# EAGLE design 00A-053 (EAGLE 9.6.2)
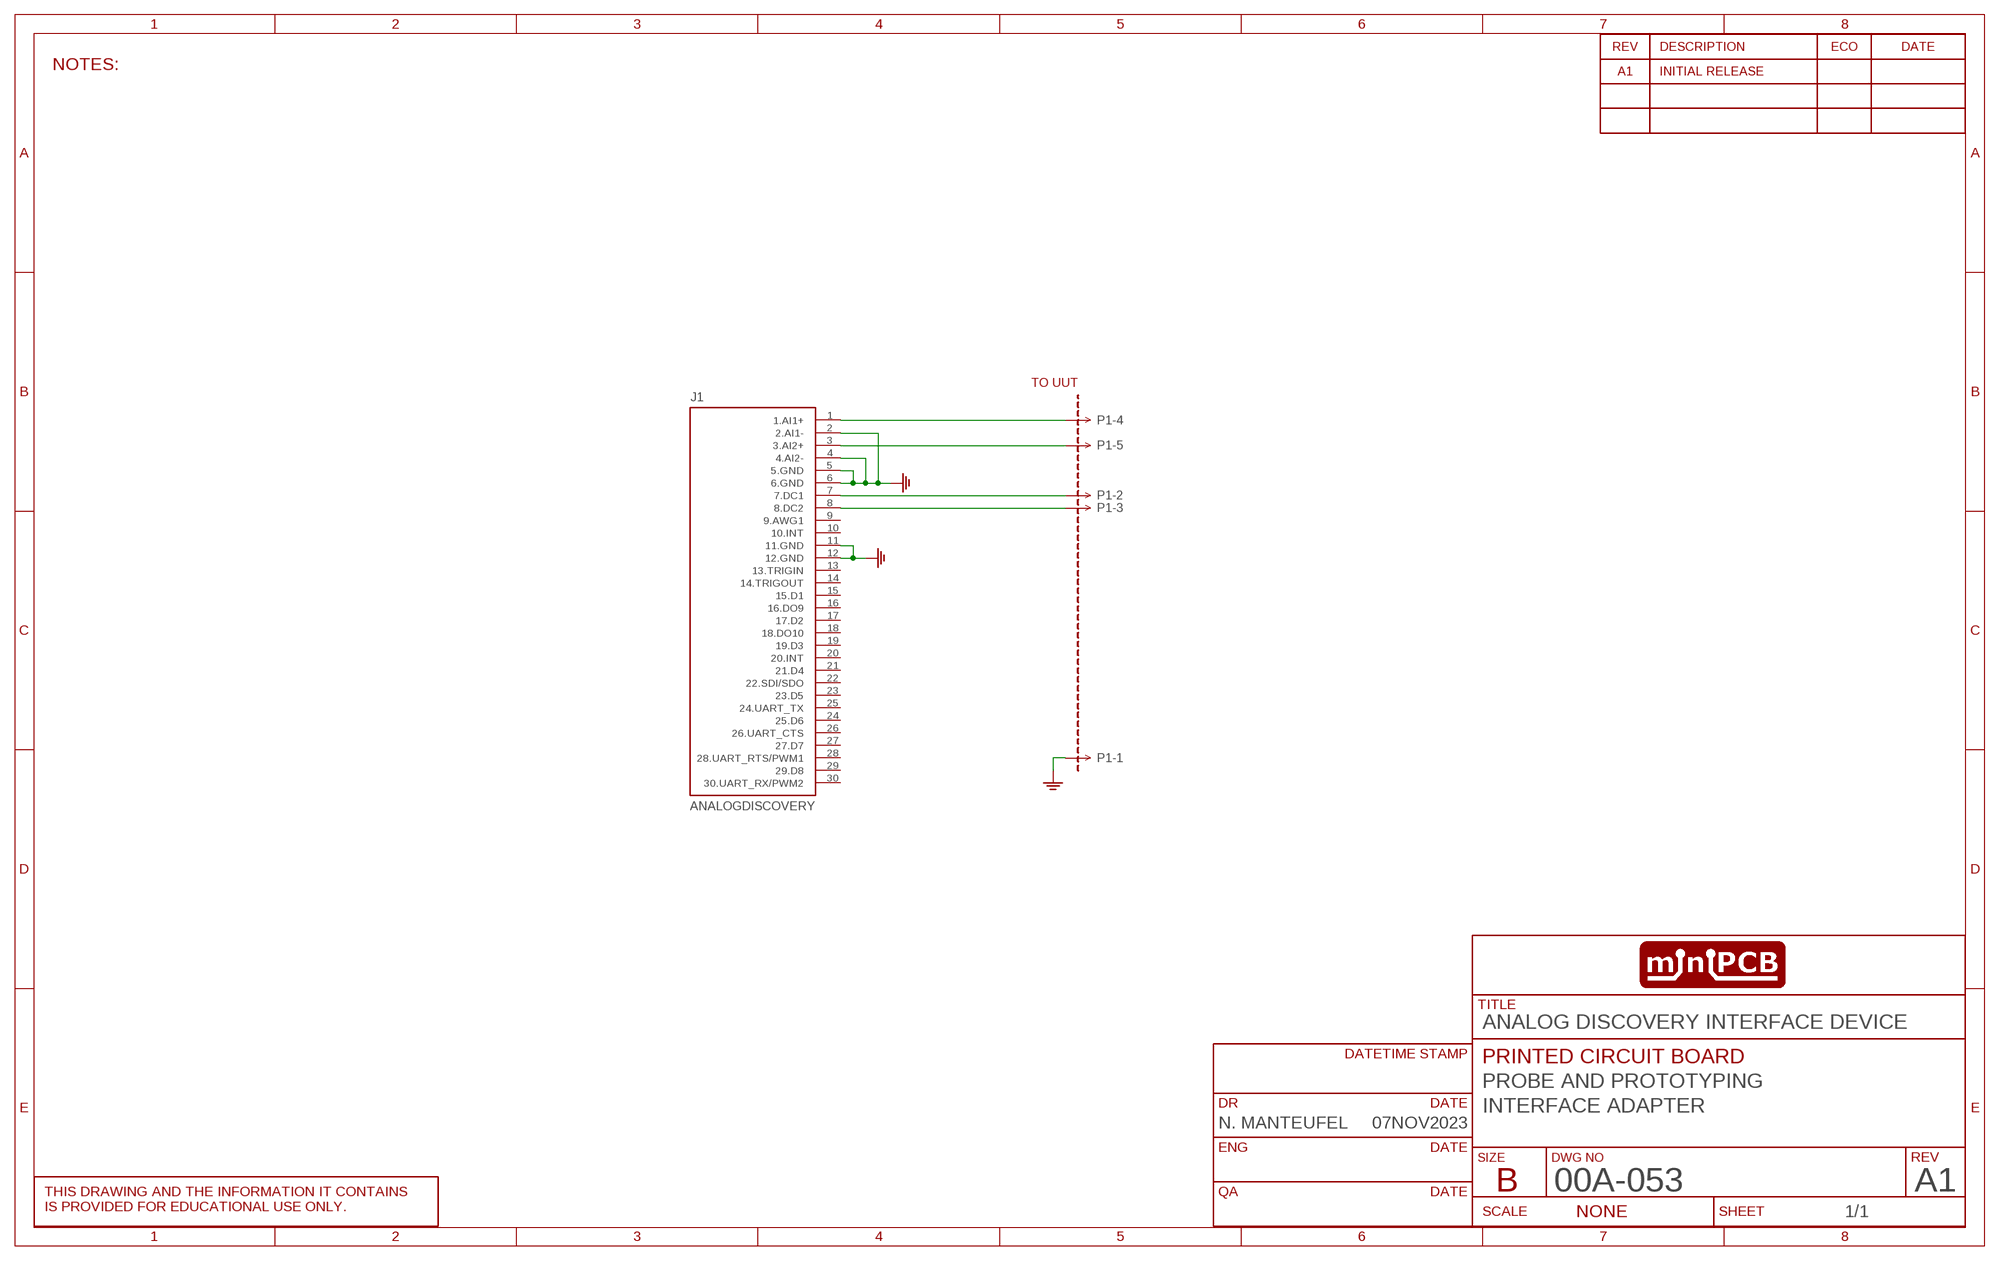
[diagram p0: schematic, sheet 1]
SHEET1 (SCHEMATIC): CIRCUIT_CATEGORY: PROBE AND PROTOTYPING; CIRCUIT_NAME: INTERFACE ADAPTER; DR: N. MANTEUFEL; DR_DATE: 07NOV2023; PCB_PCBA: PRINTED CIRCUIT BOARD; REVA: A1; REVISION: A1; TITLE: ANALOG DISCOVERY INTERFACE DEVICE

## Parts
J1  ANALOGDISCOVERY  [PINS30-2X15]
P1  MINIPCB_5P5P  [PINS_1X5]
PCB1  MINIPCB_0P25X50  [MINIPCB_0P_25X50]

## Nets
GND: J1.2(2.AI1-) J1.4(4.AI2-) J1.5(5.GND) J1.6(6.GND) J1.11(11.GND) J1.12(12.GND) P1.1
N$1: J1.3(3.AI2+) P1.5
N$2: J1.1(1.AI1+) P1.4
N$3: J1.7(7.DC1) P1.2
N$4: J1.8(8.DC2) P1.3
Unconnected: J1.9(9.AWG1) J1.10(10.INT) J1.13(13.TRIGIN) J1.14(14.TRIGOUT) J1.15(15.D1) J1.16(16.DO9) J1.17(17.D2) J1.18(18.DO10) J1.19(19.D3) J1.20(20.INT) J1.21(21.D4) J1.22(22.SDI/SDO) J1.23(23.D5) J1.24(25.D6) J1.25(24.UART_TX) J1.26(26.UART_CTS) J1.27(27.D7) J1.28(28.UART_RTS/PWM1) J1.29(29.D8) J1.30(30.UART_RX/PWM2)

## Notes on the sheet
- NOTES:

## Library data of the parts
J1 = minipcb:ANALOGDISCOVERY
P1 = minipcb:MINIPCB_5P
PCB1 = minipcb:MINIPCB_0P; NAME1: TO UUT; PART_NUMBER: 00A-053; REVISION: A1-01

## Board
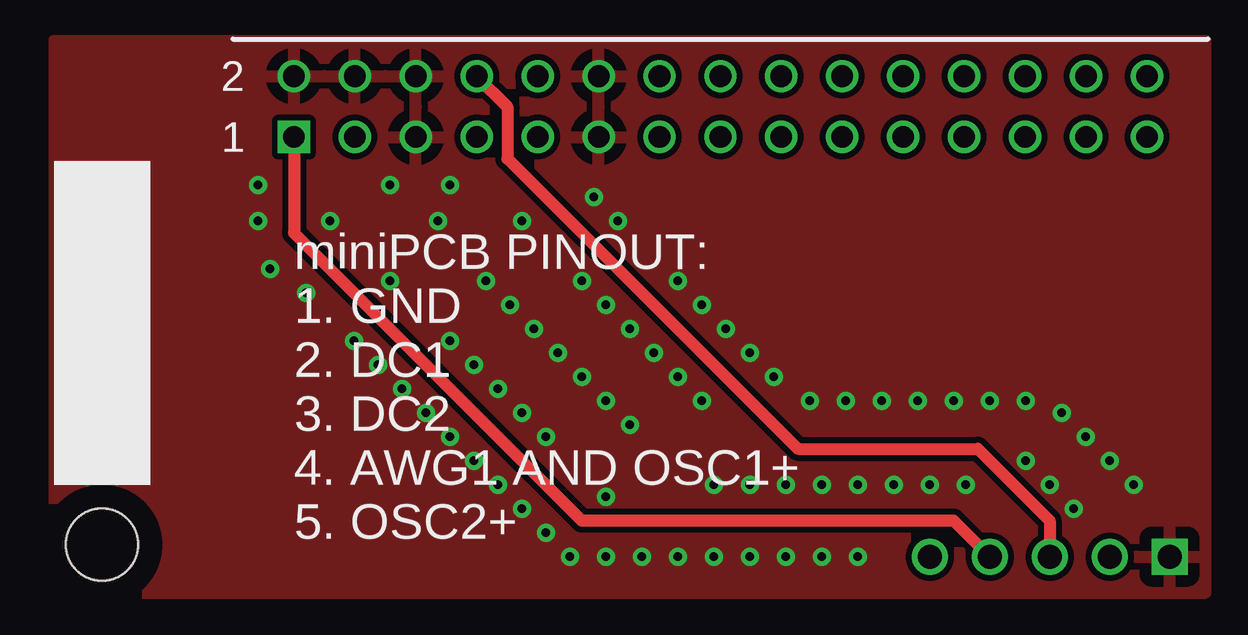
[diagram p1: board, top side]
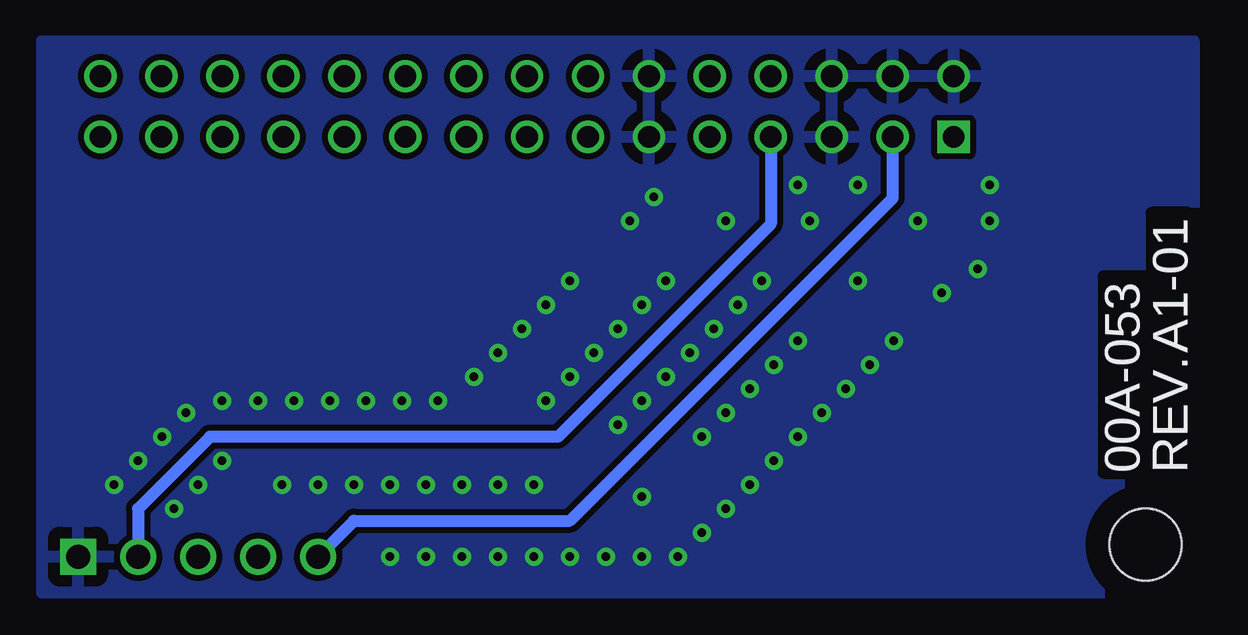
[diagram p2: board, bottom side, seen from below]

No outline drawn. Coordinates in mm, seen from the top.
Copper layers (1*16): Top 0.035mm / dielectric 1.5mm / Bottom 0.035mm
Design rules "minipcb": minimum track width 0.2mm, minimum drill 0.5mm, track to track 0.25mm, track to pad 0.5mm, pad to pad 0.5mm, via to via 0.5mm, smd to smd 0.15mm, copper to edge 1mm, drill to drill 1mm, minimum pad ring 0.2mm, minimum via ring 0.2mm, stop-mask expansion 0.1mm, vias tented up to drill 0.6mm, thermal gap 0.5mm

### Footprints (pad centres in the part's own frame; a part is rotated, then mirrored left to right if it is on the bottom)
PINS30-2X15 = drill 0.9 square: 1 0,0 | drill 0.9: 2 0,2.54; 3 2.54,0; 4 2.54,2.54; 5 5.08,0; 6 5.08,2.54; 7 7.62,0; 8 7.62,2.54; 9 10.16,0; 10 10.16,2.54; 11 12.7,0; 12 12.7,2.54; 13 15.24,0; 14 15.24,2.54; 15 17.78,0; 16 17.78,2.54; 17 20.32,0; 18 20.32,2.54; 19 22.86,0; 20 22.86,2.54; 21 25.4,0; 22 25.4,2.54; 23 27.94,0; 24 27.94,2.54; 25 30.48,0; 26 30.48,2.54; 27 33.02,0; 28 33.02,2.54; 29 35.56,0; 30 35.56,2.54
PINS_1X5 = drill 1 square: 1 0,0 | drill 1: 2 2.5,0; 3 5,0; 4 7.5,0; 5 10,0
MINIPCB_0P_25X50 = hole 3: 3,3

### Placement (x,y rotation side)
J1  11,20 0 top
P1  47.5,2.5 180 top
PCB1  0,0 0 top

### Tracks (layer width: path | path; a pad name or v marks a point on that pad's centre or on a via)
GND  (via drill 0.35)
  other vias: 39,5.5 37.5,5.5 36,5.5 34.5,5.5 33,5.5 31.5,5.5 30,5.5 28.5,5.5 32.5,9 34,9 35.5,9 37,9 38.5,9 40,9 41.5,9 43,8.5 44,7.5 45,6.5 46,5.5 41.5,6.5 42.5,5.5 43.5,4.5 34.5,2.5 33,2.5 31.5,2.5 30,2.5 28.5,2.5 27,2.5 25.5,2.5 24,5 21.5,7.5 20.5,8.5 19.5,9.5 18.5,10.5 17.5,11.5 12.5,16.5 15,14 19,14 20,13 21,12 22,11 23,10 24,9 25,8 28,9 27,10 26,11 25,12 24,13 23,14 20.5,16.5 17,16.5 17.5,18 15,18 23.5,17.5 24.5,16.5 27,14 28,13 29,12 30,11 31,10 9.5,16.5 10,14.5 11.5,13.5 13.5,11.5 14.5,10.5 15.5,9.5 16.5,8.5 17.5,7.5 18.5,6.5 19.5,5.5 20.5,4.5 21.5,3.5 24,2.5 22.5,2.5 9.5,18
  pour Top: 1,1 49,1 49,24 1,24
  pour Bottom: 1,1 49,1 49,24 1,24
N$1
  Bottom 0.5: P1.5 36,4 27,4 13.54,17.46 J1.3
N$2
  Top 0.5: P1.4 38.5,4 23,4 11,16 J1.1
N$3
  Bottom 0.5: J1.7 18.62,16.38 27.5,7.5 42,7.5 45,4.5 P1.2
N$4
  Top 0.5: J1.8 19.9,21.26 19.9,19.1 32,7 39.5,7 42.5,4 P1.3

### Text on the board
tPlace: miniPCB PINOUT: / 1. GND / 2. DC1 / 3. DC2 / 4. AWG1 AND OSC1+ / 5. OSC2+